# EasyEDA schematic a blue tooth control security light.json
TITLE: Sheet_1; REV: 1.0; Date: 2024-07-13; Sheet: 1/1; Company: Your Company
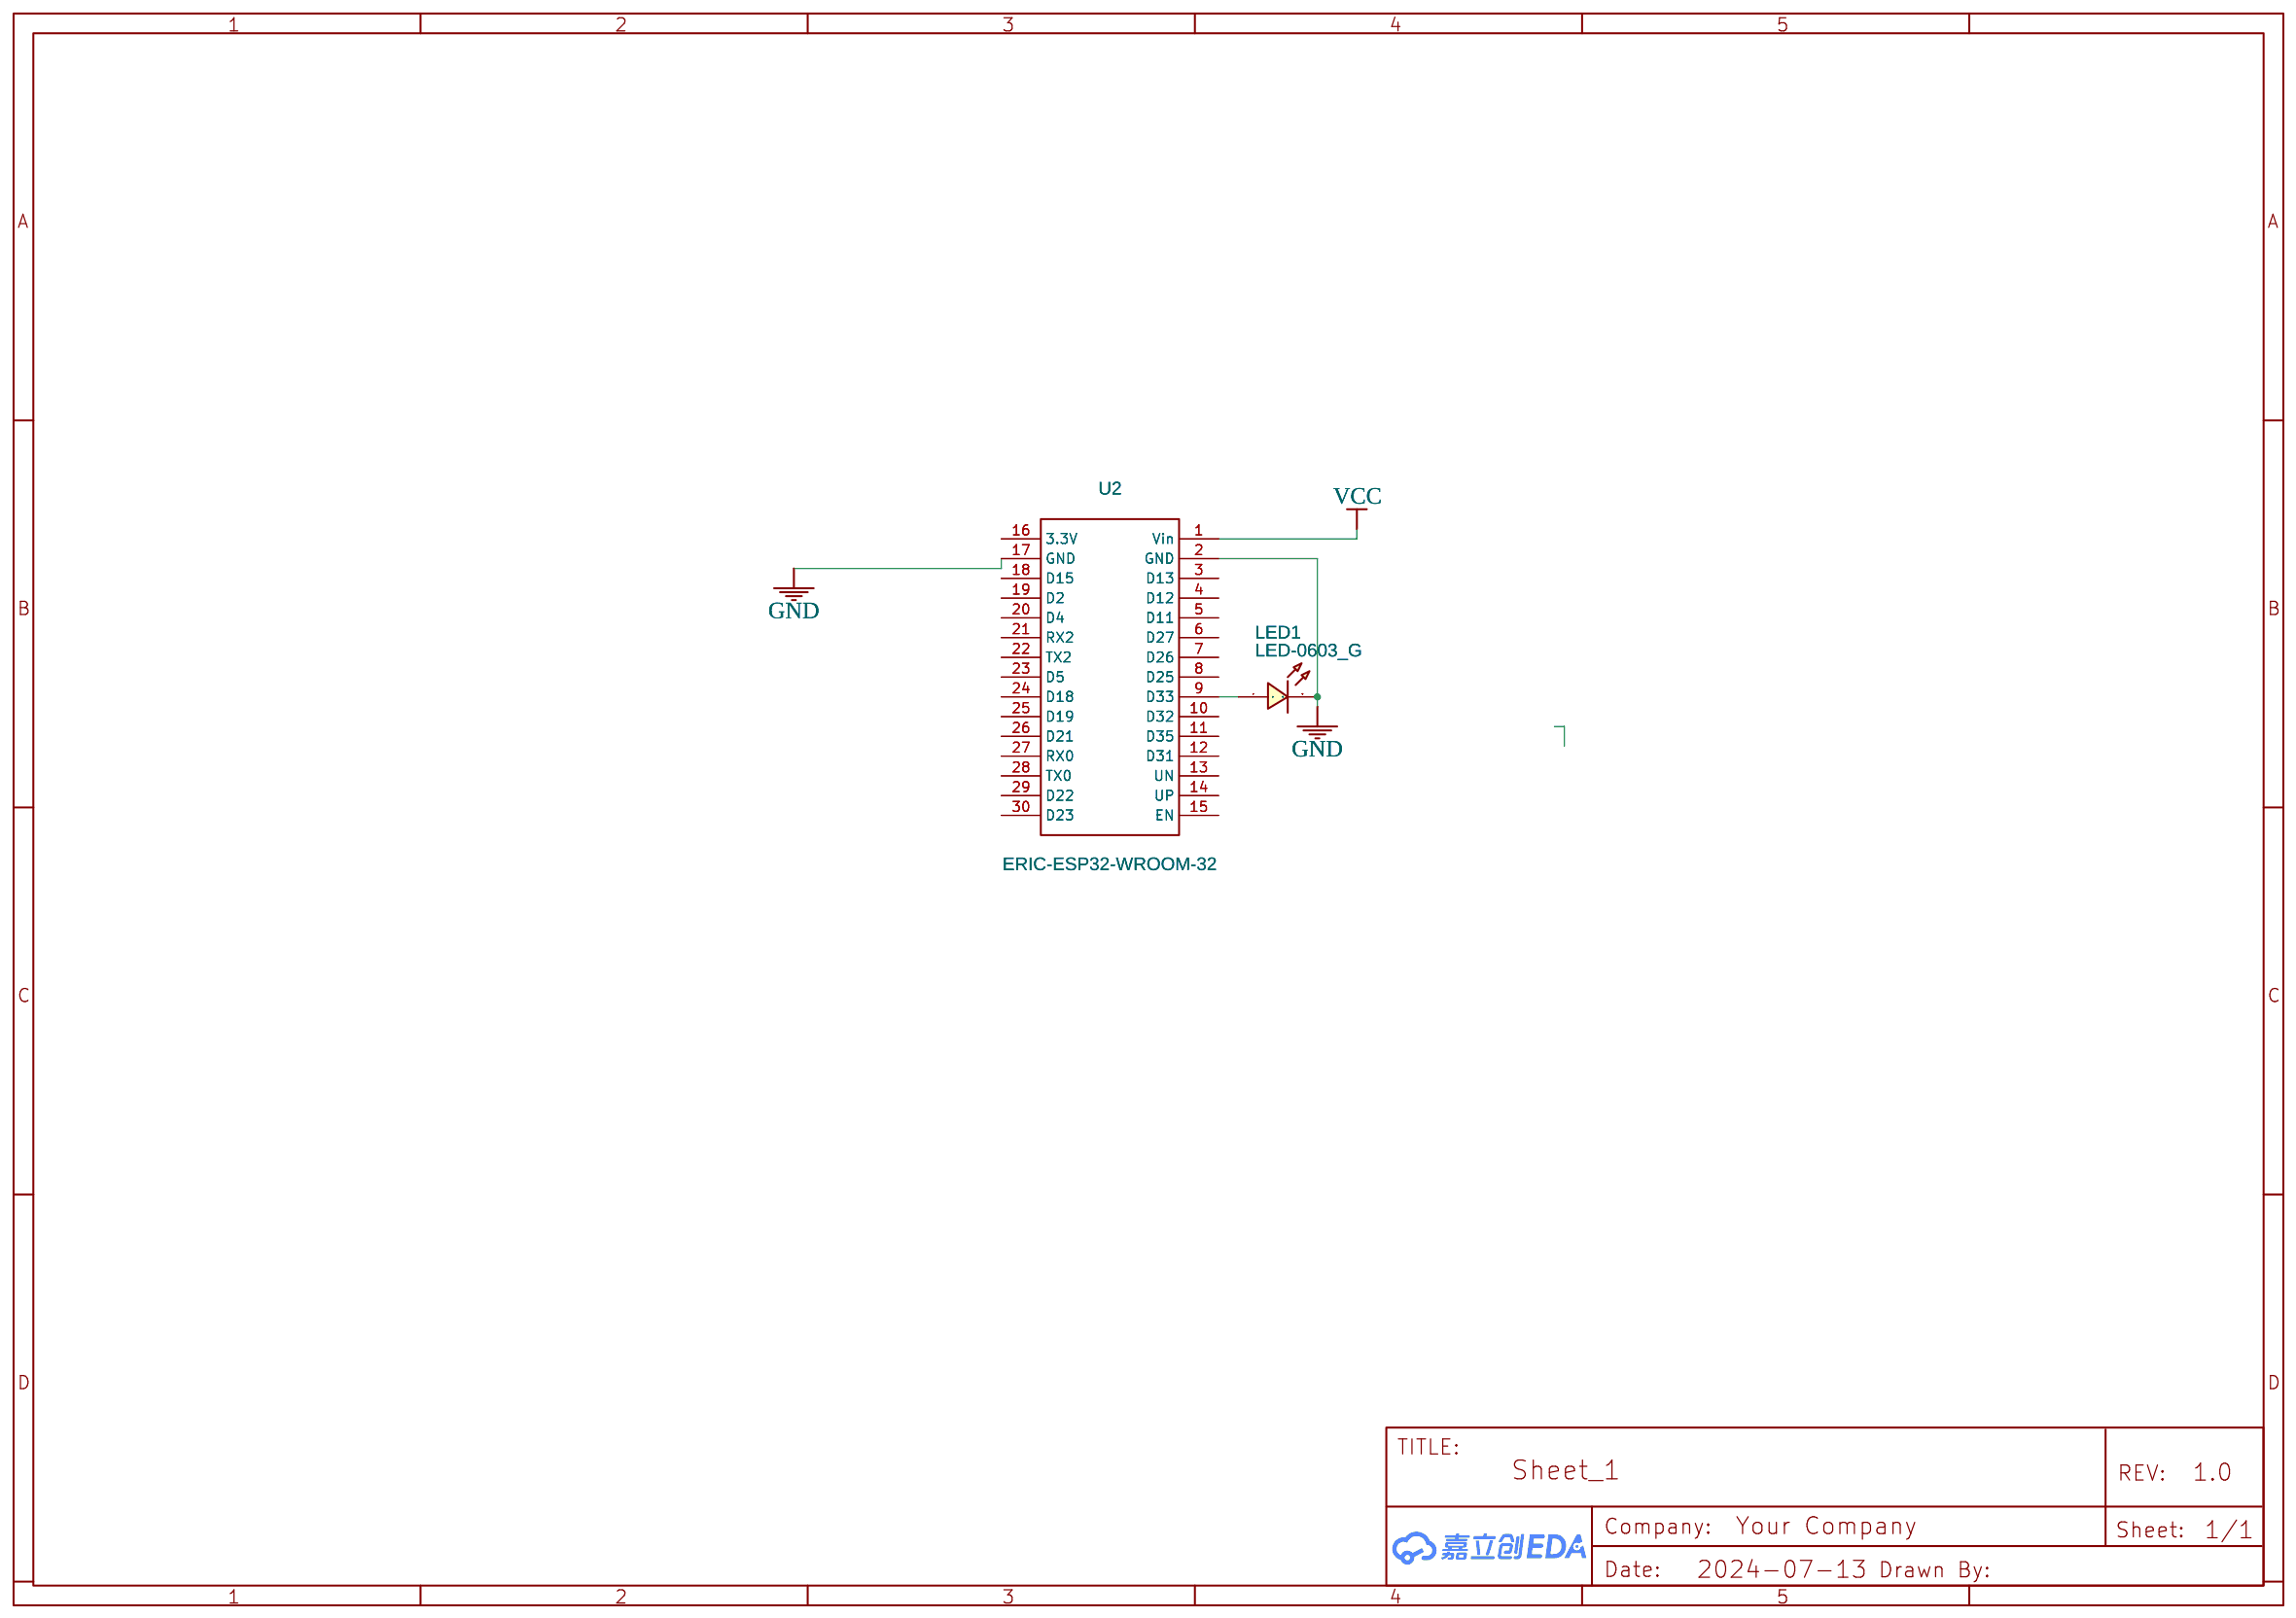
[diagram p0: schematic sheet]

## Parts
LED1  LED-0603_G  [LED0603_GREEN]
U2  ERIC-ESP32-WROOM-32  [ESP32-WROOM-32]

## Library data of the parts
LED1 = LED-0603_G: Manufacturer: EVERLIGHT(台湾亿光); Manufacturer Part: 19-217/GHC-YR1S2/3T; Supplier Part: C72043; Supplier: LCSC; Contributor: LCEDA_Lib
U2 = ESP32-WROOM-32: Manufacturer: Espressif; Supplier: Espressif; link: https://www.espressif.com/sites/default/files/documentation/esp32_datasheet_en.pdf; Contributor: M.Talmiz ur Rehman

## Nets
GND: LED1.2 U2.2(GND) U2.17(GND)
VCC: U2.1(Vin)
Net-(LED1-1): LED1.1 U2.9(D33)

Not connected (* = marked no-connect by the designer): U2 3(D13) 4(D12) 5(D11) 6(D27) 7(D26) 8(D25) 10(D32) 11(D35) 12(D31) 13(UN) 14(UP) 15(EN) 16(3.3V) 18(D15) 19(D2) 20(D4) 21(RX2) 22(TX2) 23(D5) 24(D18) 25(D19) 26(D21) 27(RX0) 28(TX0) 29(D22) 30(D23)
